# Altium schematic sheet AnalogInterface.SchDoc: Analog Interface
size Letter; Engineer: Nathan Petersen; DocumentNumber: 6; Revision: v1.2; SheetNumber: 6; SheetTotal: 23
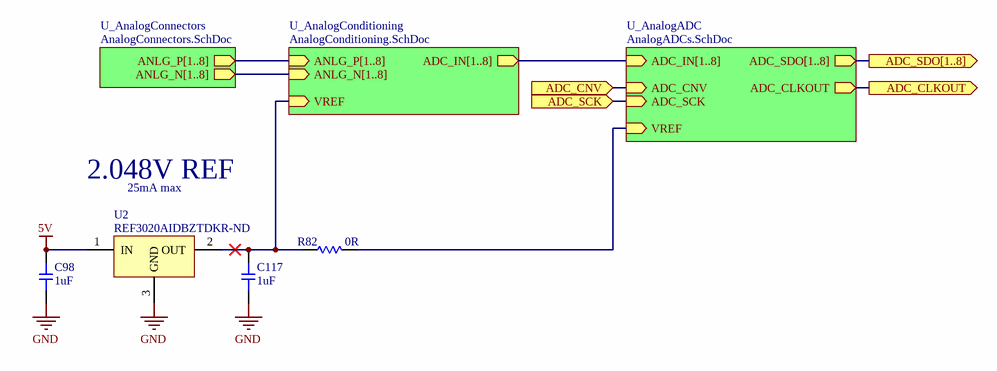
[diagram p0: AnalogInterface.SchDoc]

## Parts
C98  value 1uF  [0603-CAP]  (hidden comment: Capacitor)
C117  value 1uF  [0603-CAP]  (hidden comment: Capacitor)
R82  value 0R  [1206-RES]  (hidden comment: Resistor)
U2  Supplier Part Number 1: REF3020AIDBZTDKR-ND  [SOT23-3]  (hidden comment: REF3020AIDBZT)

## Sub-sheets
U_AnalogADC = AnalogADCs.SchDoc: ADC_IN[1..8] (in), ADC_SDO[1..8] (out), ADC_CNV (in), ADC_SCK (in), ADC_CLKOUT (out), VREF (in)
U_AnalogConditioning = AnalogConditioning.SchDoc: ADC_IN[1..8] (out), ANLG_N[1..8] (in), ANLG_P[1..8] (in), VREF (in)
U_AnalogConnectors = AnalogConnectors.SchDoc: ANLG_P[1..8] (out), ANLG_N[1..8] (out)

## Ports
ADC_CLKOUT (out), ADC_CNV (in), ADC_SCK (in), ADC_SDO[1..8] (out)

## Nets
5V: C98.2 U2.1(IN)
GND: C98.1 C117.1 U2.3(GND)
ADC_CLKOUT: port ADC_CLKOUT, sheet U_AnalogADC/ADC_CLKOUT
ADC_CNV: port ADC_CNV, sheet U_AnalogADC/ADC_CNV
ADC_SCK: port ADC_SCK, sheet U_AnalogADC/ADC_SCK
NetC117_2: C117.2 R82.1 U2.2(OUT) ; sheet U_AnalogConditioning/VREF
NetR82_2: R82.2 ; sheet U_AnalogADC/VREF

## Buses and harness runs
bus port ADC_SDO[1..8] = sheet U_AnalogADC/ADC_SDO[1..8]
bus sheet U_AnalogADC/ADC_IN[1..8] = sheet U_AnalogConditioning/ADC_IN[1..8]
bus sheet U_AnalogConditioning/ANLG_N[1..8] = sheet U_AnalogConnectors/ANLG_N[1..8]
bus sheet U_AnalogConditioning/ANLG_P[1..8] = sheet U_AnalogConnectors/ANLG_P[1..8]

## Notes on the sheet
- 2.048V REF
- 25mA max
- Title:
- File:
- Sheet:
- of
- Revision:
- Time:
- Date:
- Engineer:

## Library data of the parts
U2 = REF3020AIDBZT: Series Voltage Reference IC ±0.2% 25mA SOT-23-3; Supplier 1: Digi-Key
C98 C117 = Capacitor: Supplier 1: Digi-Key; Supplier Part Number 1: 1276-6524-6-ND
R82 = Resistor: Supplier 1: Digi-Key; Supplier Part Number 1: 311-0.0ERCT-ND